# EAGLE design rflink-litev06 (EAGLE 7.5.0)
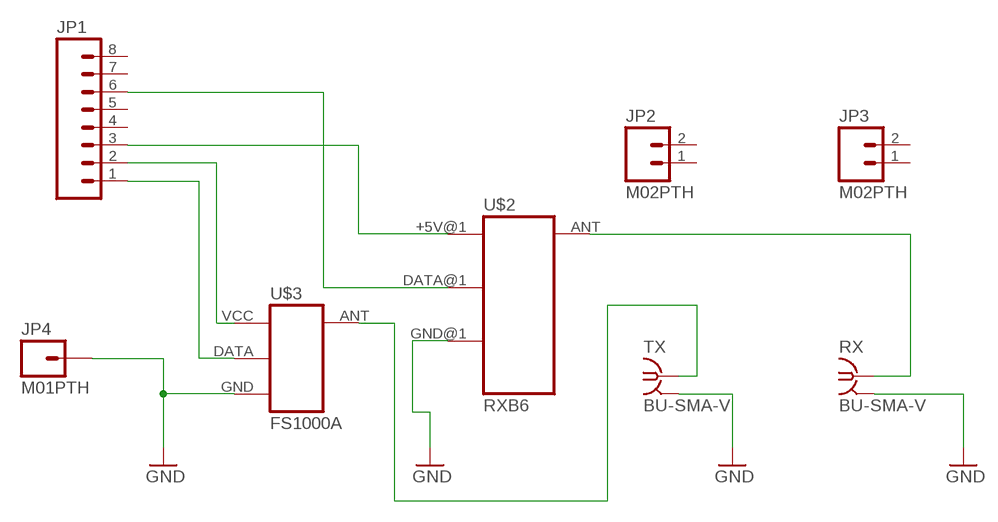
[diagram p0: schematic, sheet 1]

## Parts
JP1  M081X08  [1X08]
JP2  M02PTH  [1X02]
JP3  M02PTH  [1X02]
JP4  M01PTH  [1X01]
RX  BU-SMA-V  [BU-SMA-V]
TX  BU-SMA-V  [BU-SMA-V]
U$2  RXB6  RF-LINK_RX  [RF-LINK_RX]
U$3  FS1000A  RF-LINK_TX  [RF-LINK_TX]

## Nets
GND: JP4.1 RX.2 RX.3 RX.4 RX.5 TX.2 TX.3 TX.4 TX.5 U$2.GND@1(GND) U$3.GND
N$1: TX.1 U$3.ANT
N$2: RX.1 U$2.ANT
N$3: JP1.1 U$3.DATA
N$9: JP1.3 U$2.+5V@1(+5V)
N$10: JP1.6 U$2.DATA@1(DATA)
N$11: JP1.2 U$3.VCC(+5V)
Unconnected: JP1.4 JP1.5 JP1.7 JP1.8 JP2.1 JP2.2 JP3.1 JP3.2

## Library data of the parts
JP1 = SparkFun-Connectors:M08: Header 8 Standard 8-pin 0.1" header. Use with straight break away headers (SKU : PRT-00116), right angle break away headers (PRT-00553), swiss pins (PRT-00743), machine pins (PRT-00117), and female headers (PRT-00115).
JP2 JP3 = SparkFun-Connectors:M02: Standard 2-pin 0.1" header. Use with - straight break away headers ( PRT-00116) - right angle break away headers (PRT-00553) - swiss pins (PRT-00743) - machine pins (PRT-00117) - female headers (PRT-00115) Molex polarized connector foot print use with: PRT-08233 with associated crimp pins and housings. 2.54_SCREWTERM for use with PRT-10571. 3.5mm Screw Terminal footprints for PRT-08084 5mm Screw Terminal footprints for use with PRT-08433
JP4 = SparkFun-Connectors:M01: Header 1 Standard 1-pin 0.1" header. Use with straight break away headers (SKU : PRT-00116), right angle break away headers (PRT-00553), swiss pins (PRT-00743), machine pins (PRT-00117), and female headers (PRT-00115).
RX TX = con-coax:BU-SMA-V: FEMALE SMA CONNECTOR Radiall distributor RS 112-3794; OC_FARNELL: unknown; OC_NEWARK: unknown
U$2 = SparkFun-RFnew:RF-LINK_RX: RF Link receivers- WRL-8947, 8948, 8949, 8950
U$3 = SparkFun-RFnew:RF-LINK_TX: RF Link transmitters WRL-8945, 8946

## Board
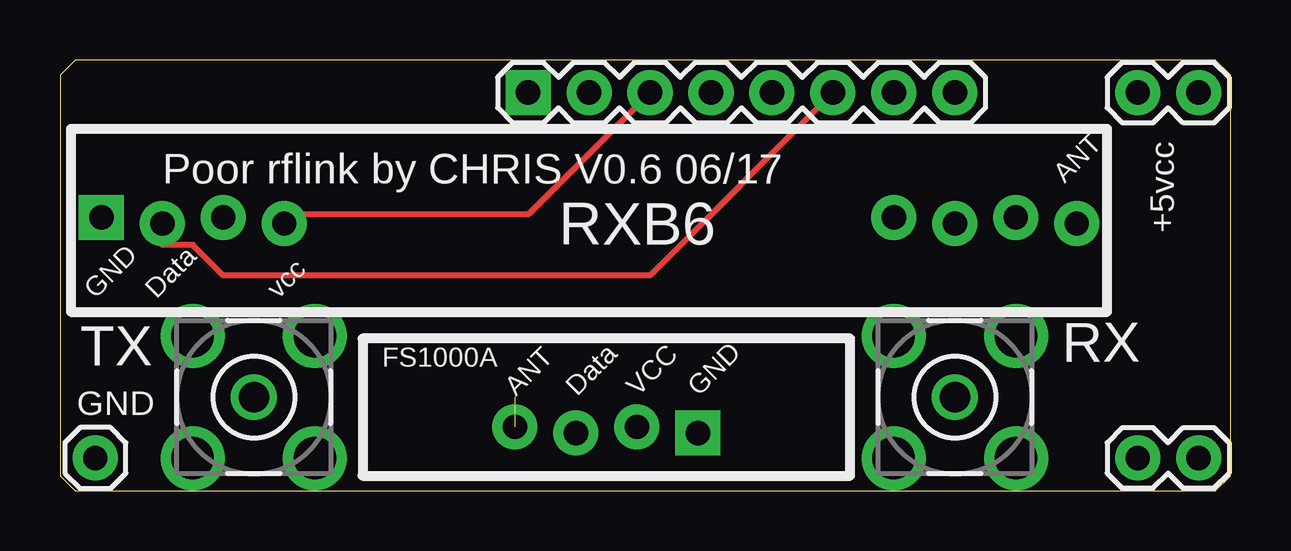
[diagram p1: board, top side]
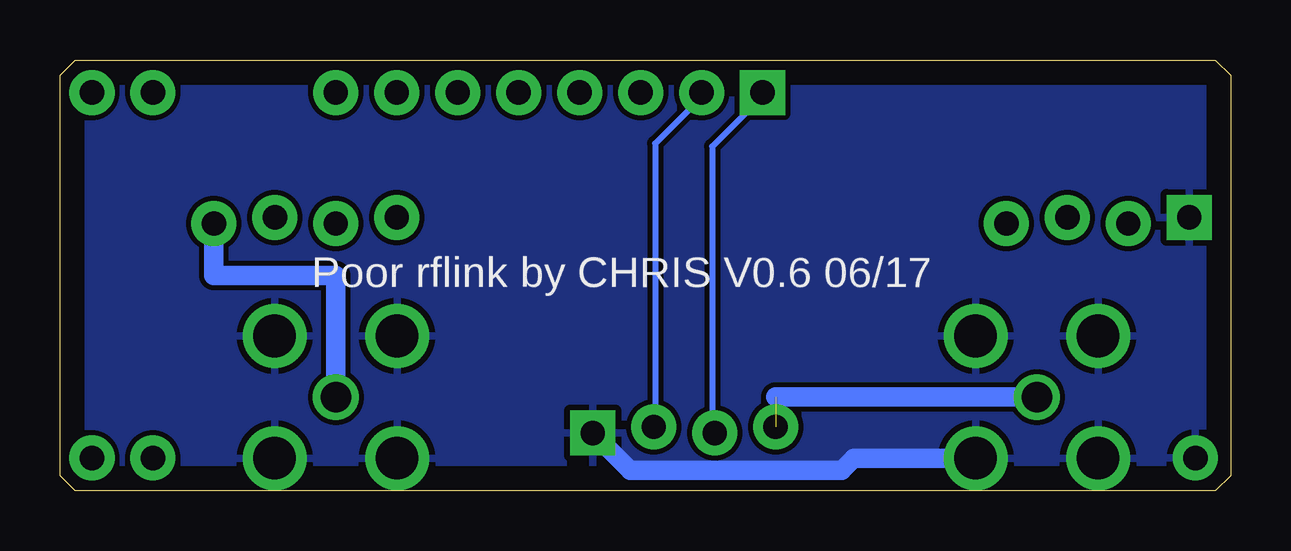
[diagram p2: board, bottom side, seen from below]

Size 48.78 x 17.97 mm. Coordinates in mm from the lower left corner, seen from the top.
Outline: 0,17.34 0,0.64 0.63,0 48.14,0 48.78,0.64 48.78,17.34 48.14,17.97 0.63,17.97 0,17.34
Copper layers (1*16): Top 0.035mm / dielectric 1.5mm / Bottom 0.035mm
Design rules "default": minimum track width 10mil, minimum drill 24mil, track to track 8mil, track to pad 8mil, pad to pad 8mil, via to via 8mil, smd to smd 8mil, copper to edge 40mil, drill to drill 8mil, minimum pad ring 10mil, minimum via ring 8mil, stop-mask expansion 4mil, vias tented up to drill 0mil, thermal gap 10mil

### Footprints (pad centres in the part's own frame; a part is rotated, then mirrored left to right if it is on the bottom)
1X08 = drill 1.016 pad 1.88 square: 1 0,0 | drill 1.016 pad 1.88: 2 2.54,0; 3 5.08,0; 4 7.62,0; 5 10.16,0; 6 12.7,0; 7 15.24,0; 8 17.78,0
1X02 = drill 1.016 pad 1.88: 1 0,0; 2 2.54,0
1X01 = drill 1.016 pad 1.88: 1 0,0
BU-SMA-V = drill 1.27: 1 0,0 | drill 1.778: 2 -2.55,2.55; 3 2.55,2.55; 4 2.55,-2.55; 5 -2.55,-2.55
RF-LINK_RX = drill 1.016 pad 1.88: +5V@1 7.62,-0.127; +5V@2 33.02,0.127; ANT 40.64,-0.127; DATA@1 2.54,-0.127; DATA@2 5.08,0.127; GND@2 35.56,-0.127; GND@3 38.1,0.127 | drill 1.016 pad 1.88 square: GND@1 0,0.127
RF-LINK_TX = drill 1.016 pad 1.88: ANT 7.62,-0.127; DATA 5.08,0.127; VCC 2.54,-0.127 | drill 1.016 pad 1.88 square: GND 0,0.127

### Placement (x,y rotation side)
JP1  19.5,16.61 0 top
JP2  44.9,16.61 0 top
JP3  44.9,1.37 0 top
JP4  1.47,1.37 0 top
RX  37.28,3.91 0 top
TX  8.07,3.91 0 top
U$2  1.72,11.28 0 top
U$3  26.58,2.54 180 top

### Tracks (layer width: path | path; a pad name or v marks a point on that pad's centre or on a via)
GND
  Bottom 0.813: TX.4 15.7,1.36 16.2,0.86 25.02,0.86 U$3.GND
  pour Bottom: 0.2,18.64 49.22,18.64 49.22,-1.42 0.2,-1.42
N$1  (1 unrouted)
  Bottom 0.813: TX.1 18.96,3.91
N$2
  Bottom 0.813: U$2.ANT 42.36,8.99 37.28,8.99 RX.1
N$3
  Bottom 0.254: U$3.DATA 21.6,2.49 21.6,14.37 19.48,16.49 JP1.1
N$9
  Top 0.254: JP1.3 19.5,11.53 9.34,11.53 U$2.+5V@1
N$10
  Top 0.254: JP1.6 24.58,8.99 6.8,8.99 5.53,10.26 4.26,10.26 U$2.DATA@1
N$11
  Bottom 0.254: U$3.VCC 23.98,2.74 23.98,14.49 21.98,16.49 JP1.2

### Text on the board
tNames: Poor rflink by CHRIS V0.6 06/17 | ANT | RXB6 | +5vcc | GND | Data | vcc | FS1000A | GND | ANT | Data | VCC | GND
bNames: Poor rflink by CHRIS V0.6 06/17